# EAGLE design old_kick_line (EAGLE 7.7.0)
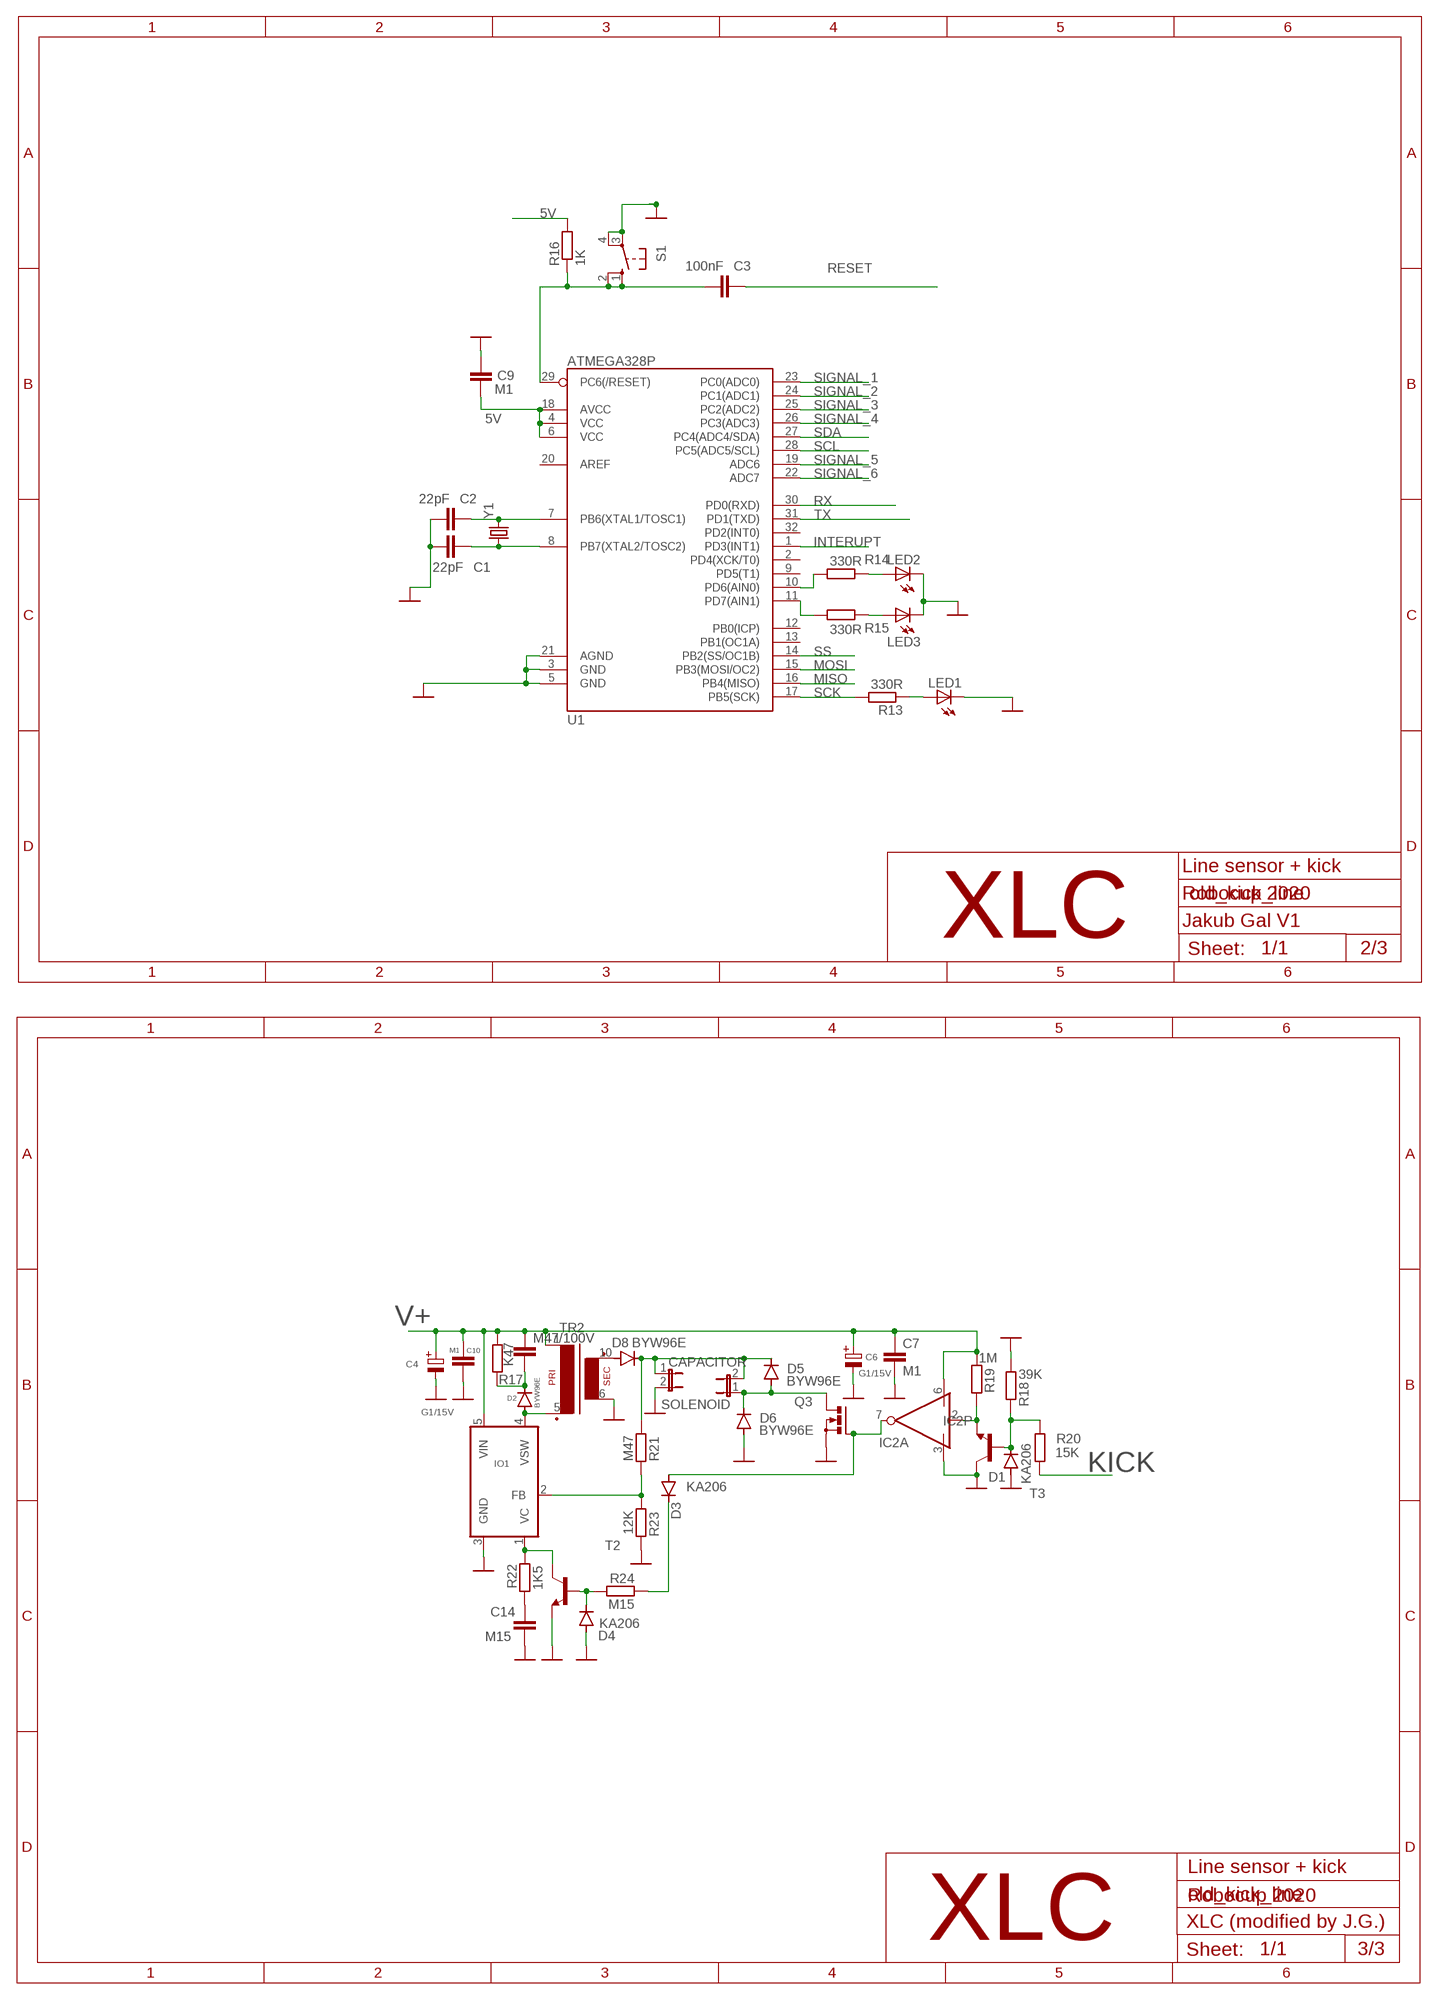
[diagram p0: schematic, sheet 1, part 1 of 2]
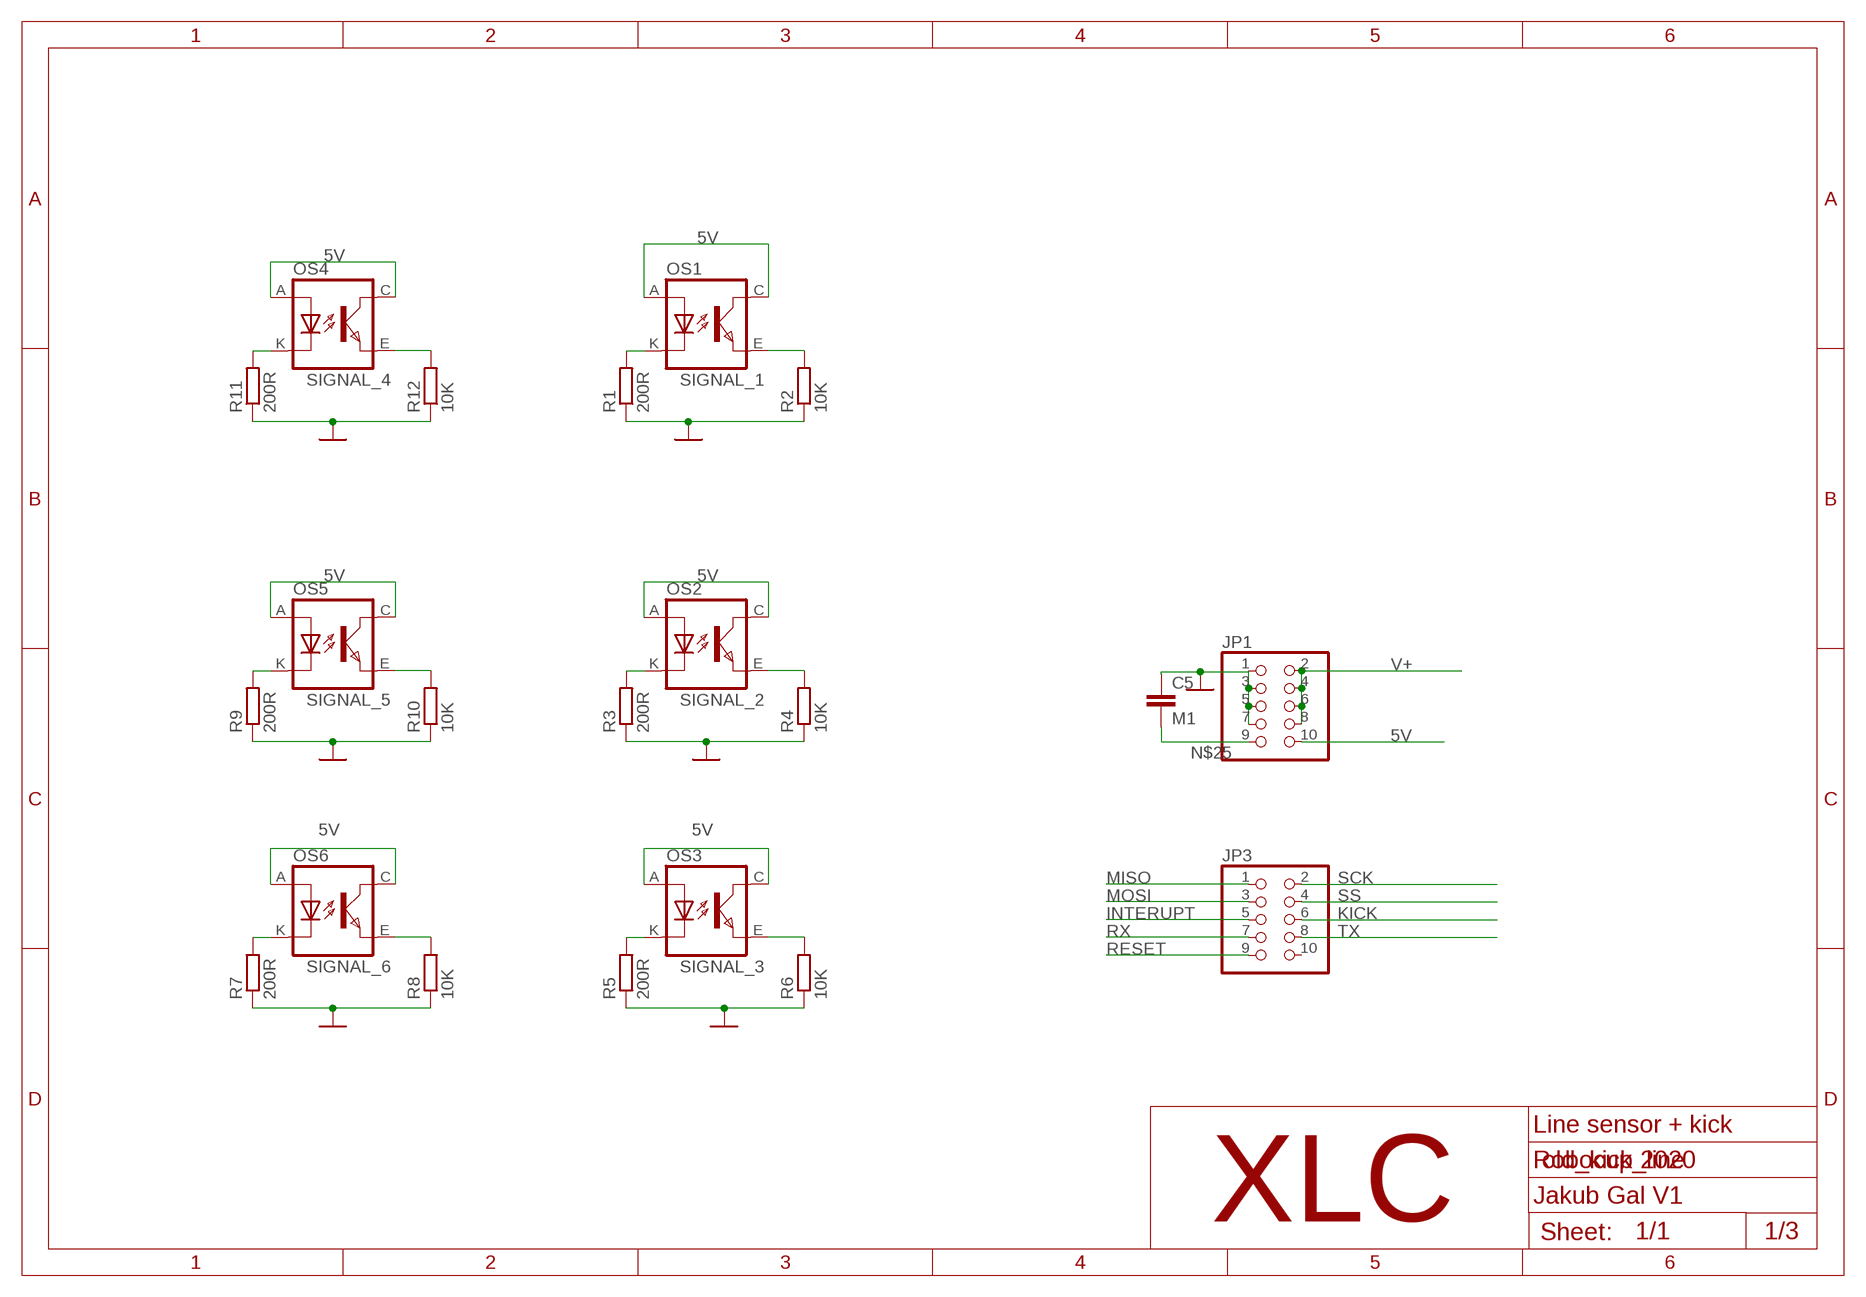
[diagram p1: schematic, sheet 1, part 2 of 2]

## Parts
C1  22pF  C-EUC0603  [C0603]
C2  22pF  C-EUC0603  [C0603]
C3  100nF  C-EUC0603  [C0603]
C4  G1/15V  KOND-ELEKT-2,5/7  [E-2,5/7-RAD]
C5  M1  C-EUC0603  [C0603]
C6  G1/15V  KOND-ELEKT-2,5/7  [E-2,5/7-RAD]
C7  M1  C-EUC0805K  [C0805K]
C9  M1  C-EUC0603  [C0603]
C10  M1  C-EUC0805K  [C0805K]
C14  M15  C-EUC0805K  [C0805K]
CAPACITOR  JP1E  [JP1]
D1  KA206  DIODE-D-7.5  [D-7.5]
D2  BYW96E  BYW96  [SOD64-10]
D3  KA206  DIODE-D-7.5  [D-7.5]
D4  KA206  DIODE-D-7.5  [D-7.5]
D5  BYW96E  BYW96  [SOD64-10]
D6  BYW96E  BYW96  [SOD64-10]
D8  BYW96E  BYW96  [SOD64-10]
IC2  MIC4423BM  [SO08]
IO1  LT1071V  [TO220-5P]
JP1  PINHD-2X5IDC  [2X05_IDC]
JP3  PINHD-2X5IDC  [2X05_IDC]
LED1  LEDCHIPLED_0603  [CHIPLED_0603]
LED2  LEDCHIPLED_0603  [CHIPLED_0603]
LED3  LEDCHIPLED_0603  [CHIPLED_0603]
M47/100V  C-EUC0805K  [C0805K]
OS1  TCRT5000  [TCRT5000]
OS2  TCRT5000  [TCRT5000]
OS3  TCRT5000  [TCRT5000]
OS4  TCRT5000  [TCRT5000]
OS5  TCRT5000  [TCRT5000]
OS6  TCRT5000  [TCRT5000]
Q3  PMOSFET_NTO220BV  [TO220BV]
R1  200R  R-EU_R0603  [R0603]
R2  10K  R-EU_R0603  [R0603]
R3  200R  R-EU_R0603  [R0603]
R4  10K  R-EU_R0603  [R0603]
R5  200R  R-EU_R0603  [R0603]
R6  10K  R-EU_R0603  [R0603]
R7  200R  R-EU_R0603  [R0603]
R8  10K  R-EU_R0603  [R0603]
R9  200R  R-EU_R0603  [R0603]
R10  10K  R-EU_R0603  [R0603]
R11  200R  R-EU_R0603  [R0603]
R12  10K  R-EU_R0603  [R0603]
R13  330R  R-EU_R0603  [R0603]
R14  330R  R-EU_R0603  [R0603]
R15  330R  R-EU_R0603  [R0603]
R16  1K  R-EU_R0603  [R0603]
R17  K47  R-EU_R0603  [R0603]
R18  39K  R-EU_R0603  [R0603]
R19  1M  R-EU_R0603  [R0603]
R20  15K  R-EU_R0603  [R0603]
R21  M47  R-EU_R0603  [R0603]
R22  1K5  R-EU_R0603  [R0603]
R23  12K  R-EU_R0603  [R0603]
R24  M15  R-EU_R0603  [R0603]
S1  10-XX  [B3F-10XX]
SOLENOID  JP1E  [JP1]
T2  -NPN-SC59-BEC  [SC59-BEC]
T3  -NPN-SC59-BEC  [SC59-BEC]
TR2  TRAFO-E10-R""  [TRAFO-EE17X20]
U1  ATMEGA328P  ATMEGA328_SMT  [TQFP32-08]
Y1  CRYSTALHC49US  [HC49US]

## Nets
5V: C9.1 JP1.10 OS1.A(ANODE) OS1.C(COLLECTOR) OS2.A(ANODE) OS2.C(COLLECTOR) OS3.A(ANODE) OS3.C(COLLECTOR) OS4.A(ANODE) OS4.C(COLLECTOR) OS5.A(ANODE) OS5.C(COLLECTOR) OS6.A(ANODE) OS6.C(COLLECTOR) R16.2 U1.4(VCC) U1.6(VCC) U1.18(AVCC)
GND: C1.1 C2.1 C4.- C5.1 C6.- C7.2 C9.2 C10.2 C14.2 CAPACITOR.2 D1.A D4.A D6.A IC2.3(P:GND) IO1.3(GND) JP1.1 JP1.3 JP1.5 JP1.7 LED1.C LED2.C LED3.C Q3.S R1.1 R2.1 R3.1 R4.1 R5.1 R6.1 R7.1 R8.1 R9.1 R10.1 R11.1 R12.1 R18.2 R23.1 S1.3(P) S1.4(P1) T2.E T3.C TR2.6 U1.3(GND) U1.5(GND) U1.21(AGND)
INTERUPT: JP3.5 U1.1(PD3(INT1))
KICK: JP3.6 R20.1
MISO: JP3.1 U1.16(PB4(MISO))
MOSI: JP3.3 U1.15(PB3(MOSI/OC2))
N$1: OS1.K(CATHODE) R1.2
N$2: OS2.K(CATHODE) R3.2
N$3: OS3.K(CATHODE) R5.2
N$4: OS6.K(CATHODE) R7.2
N$5: OS5.K(CATHODE) R9.2
N$6: OS4.K(CATHODE) R11.2
N$7: C2.2 U1.7(PB6(XTAL1/TOSC1)) Y1.2
N$8: C1.2 U1.8(PB7(XTAL2/TOSC2)) Y1.1
N$9: IO1.1(VC) R22.1 T2.C
N$10: C14.1 R22.2
N$11: D8.A TR2.10
N$12: D3.A IC2.7(A:OUT) Q3.G
N$13: CAPACITOR.1 D5.C D8.C R21.2 SOLENOID.2
N$14: IO1.2(FB) R21.1 R23.2
N$15: D4.C R24.2 T2.B
N$16: C3.1 R16.1 S1.1(S) S1.2(S1) U1.29(PC6(/RESET))
N$17: LED1.A R13.1
N$18: IC2.2(A:IN) R19.1 T3.E
N$19: LED2.A R14.1
N$20: R15.2 U1.11(PD7(AIN1))
N$21: LED3.A R15.1
N$22: R14.2 U1.10(PD6(AIN0))
N$23: D2.A IO1.4(VSW) TR2.5
N$24: D2.C M47/100V.2 R17.2
N$25: C5.2 JP1.9
N$26: D5.A D6.C Q3.D SOLENOID.1
N$29: D3.C R24.1
N$31: D1.C R18.1 R20.2 T3.B
RESET: C3.2 JP3.9
RX: JP3.7 U1.30(PD0(RXD))
SCK: JP3.2 R13.2 U1.17(PB5(SCK))
SCL: U1.28(PC5(ADC5/SCL))
SDA: U1.27(PC4(ADC4/SDA))
SIGNAL_1: OS1.E(EMITTER) R2.2 U1.23(PC0(ADC0))
SIGNAL_2: OS2.E(EMITTER) R4.2 U1.24(PC1(ADC1))
SIGNAL_3: OS3.E(EMITTER) R6.2 U1.25(PC2(ADC2))
SIGNAL_4: OS4.E(EMITTER) R12.2 U1.26(PC3(ADC3))
SIGNAL_5: OS5.E(EMITTER) R10.2 U1.19(ADC6)
SIGNAL_6: OS6.E(EMITTER) R8.2 U1.22(ADC7)
SS: JP3.4 U1.14(PB2(SS/OC1B))
TX: JP3.8 U1.31(PD1(TXD))
V+: C4.+ C6.+ C7.1 C10.1 IC2.6(P:V+) IO1.5(VIN) JP1.2 JP1.4 JP1.6 JP1.8 M47/100V.1 R17.1 R19.2 TR2.1
Unconnected: IC2.4(B:IN) IC2.5(B:OUT) JP3.10 U1.2(PD4(XCK/T0)) U1.9(PD5(T1)) U1.12(PB0(ICP)) U1.13(PB1(OC1A)) U1.20(AREF) U1.32(PD2(INT0))

## Notes on the sheet
- Line sensor + kick
- Robocup 2020
- Jakub Gal V1
- XLC
- 2/3
- Line sensor + kick
- Robocup 2020
- XLC (modified by J.G.)
- XLC
- 3/3
- Line sensor + kick
- Robocup 2020
- Jakub Gal V1
- XLC
- 1/3

## Library data of the parts
C1-C3 C9 = rcl@1:C-EU: CAPACITOR, European symbol
C4 C6 = TABOR K1:KOND-ELEKT: Kondenzátor elektrolyticky
C5 = rcl:C-EU: CAPACITOR, European symbol; SPICEPREFIX: C
C7 C10 C14 M47/100V = resistor:C-EU: CAPACITOR, European symbol
CAPACITOR SOLENOID = jumper:JP1E: JUMPER
D1 D3 D4 = diode:DIODE-: DIODE
D2 D5 D6 D8 = diode:BYW96: DIODE fast soft-recovery rectifier
IC2 = TABOR K1:MIC4423B: 2x Invertor driver MOSFET
IO1 = TABOR K1:LT1071: DC/DC pulzny IO
JP1 JP3 = pinhead-1:PINHD-2X5: PIN HEADER
LED1-LED3 = audio amplifier example:LED
OS1-OS3 OS5 = tcrt5000:TCRT5000
OS4 OS6 = tcrt5000:TCRT5000; SPICEPREFIX: O
Q3 = transistor-power:PMOSFET_N: Power MOSFET N-Channel
R1-R16 = rcl:R-EU_: RESISTOR, European symbol; SPICEPREFIX: R
R17-R24 = resistor:R-EU_: RESISTOR, European symbol
S1 = switch-omron:10-XX: OMRON SWITCH; MPN: B3F-1000; OC_FARNELL: 176432; OC_NEWARK: 36M3542
T2 T3 = DC_LOAD_AU:*-NPN-: NPN Transistror BF959 corrected 2008.03.06
TR2 = TABOR K1:TRAFO-E10-R: Transformátor s feritovym jadrom EE17x20: 1x primár, 1x sekundár
U1 = SparkFun-DigitalIC:ATMEGA328_SMT: 32-Pin Atmega328 part Commonly used on Arduino compatible boards Available in QFP and QFN packages TQFP is IC-09069 QFN is non-stock; PROD_ID: IC-09069
Y1 = SparkFun-FreqCtrl:CRYSTAL: Various standard crystals. Proven footprints. Spark Fun Electronics SKU : COM-00534

## Board
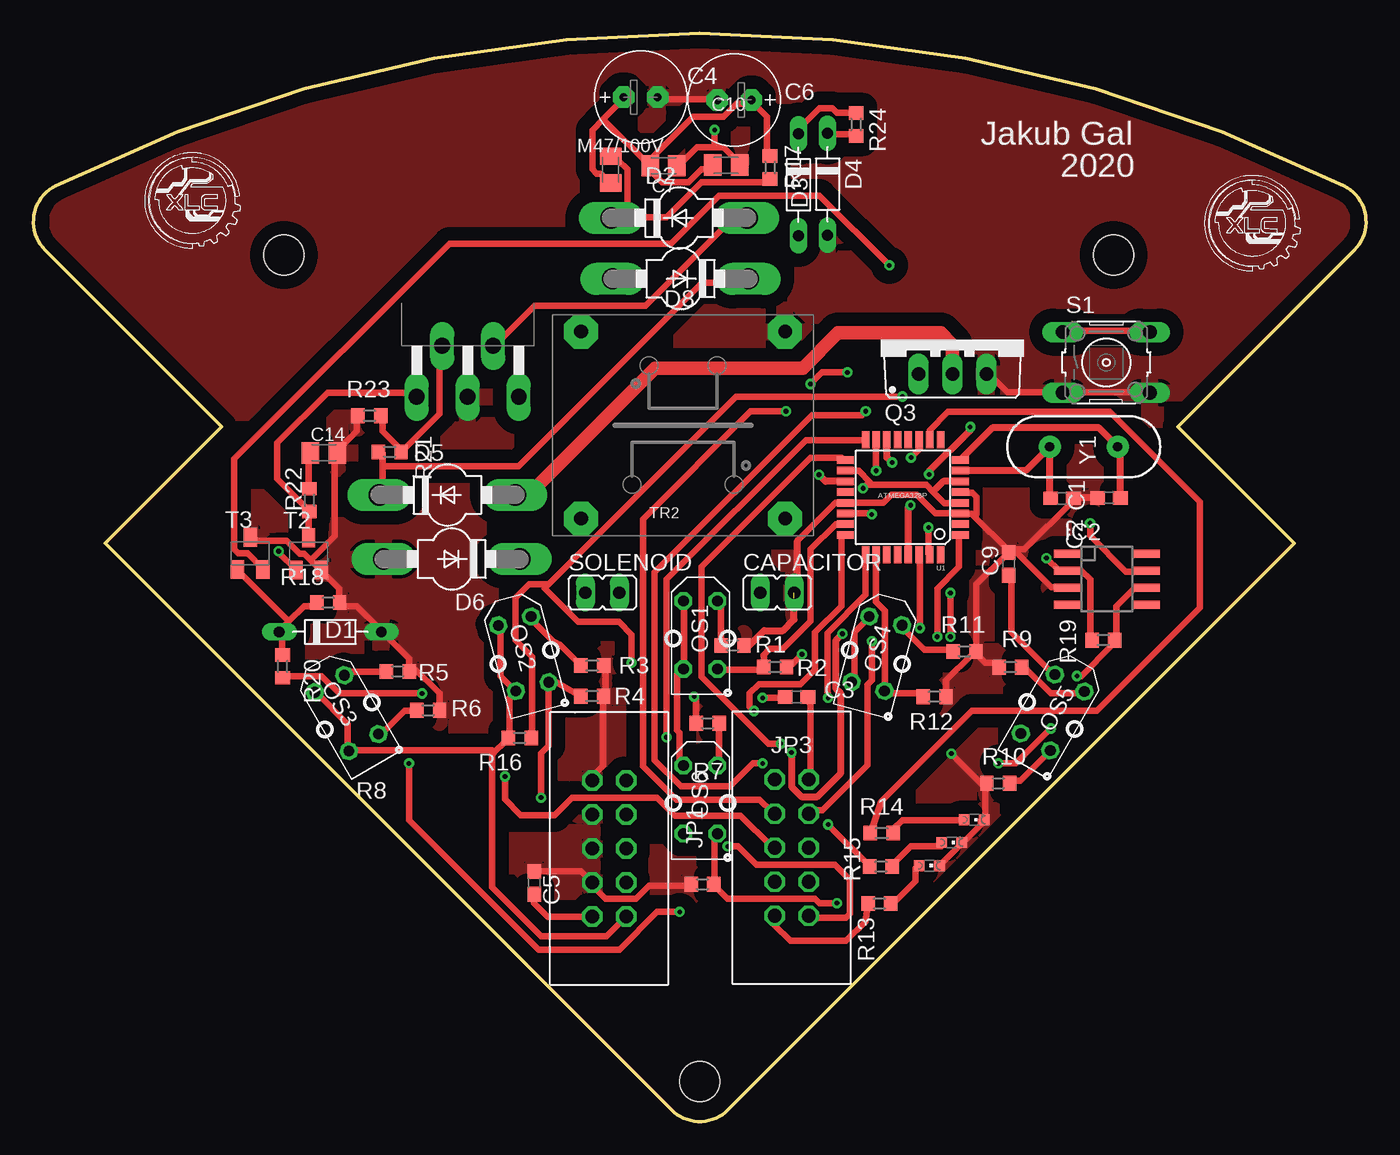
[diagram p2: board, top side]
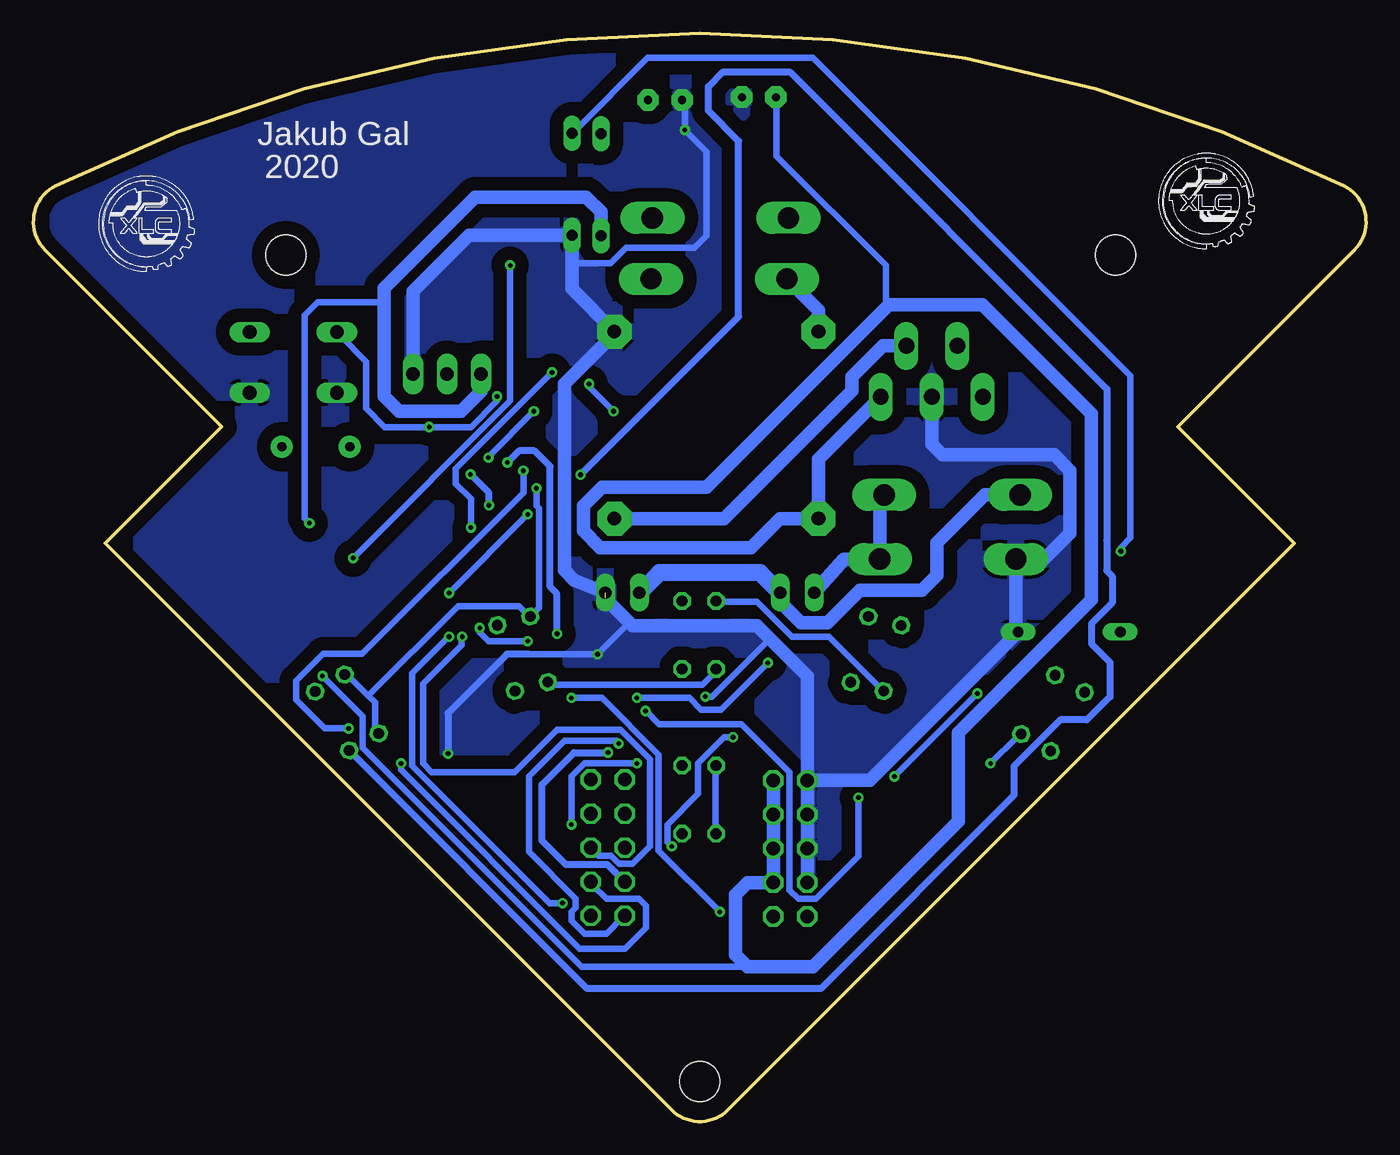
[diagram p3: board, bottom side, seen from below]

Size 99.55 x 81.25 mm. Coordinates in mm from the lower left corner, seen from the top.
Outline: 85.49,51.89 98.67,65.08 arc108 97.9,69.88 arc53 1.66,69.88 arc108 0.88,65.08 14.07,51.89 5.35,43.18 47.66,0.87 arc90 51.9,0.87 94.2,43.18 85.49,51.89
Copper layers (1*16): Top 0.035mm / dielectric 1.5mm / Bottom 0.035mm
Design rules "default *": minimum track width 0.5mm, minimum drill 0.35mm, track to track 6mil, track to pad 6mil, pad to pad 6mil, via to via 6mil, smd to smd 6mil, copper to edge 40mil, drill to drill 6mil, minimum pad ring 10mil, minimum via ring 8mil, stop-mask expansion 4mil, vias tented up to drill 0mil, thermal gap 10mil
Holes 3 mm at 49.78,3 18.71,64.71 80.71,64.71

### Footprints (pad centres in the part's own frame; a part is rotated, then mirrored left to right if it is on the bottom)
C0603 = smd 1.1 x 1: 1 -0.85,0; 2 0.85,0
E-2,5/7-RAD = drill 0.61 pad 1.6 octagon: + -1.27,0; - 1.27,0
C0805K = smd 1.3 x 1.6: 1 -1,0; 2 1,0
JP1 = drill 0.914 long: 1 0,-1.27; 2 0,1.27
D-7.5 = drill 0.813 long: A 3.81,0; C -3.81,0
SOD64-10 = drill 1.6 long: A 5.08,0; C -5.08,0
SO08 = smd 0.61 x 1.981: 1 -1.905,-2.972; 2 -0.635,-2.972; 3 0.635,-2.972; 4 1.905,-2.972; 5 1.905,2.972; 6 0.635,2.972; 7 -0.635,2.972; 8 -1.905,2.972
TO220-5P = drill 1.194 pad 1.676 long: 1 -3.81,0; 2 -1.905,3.81; 3 0,0; 4 1.905,3.81; 5 3.81,0
2X05_IDC = drill 1.016 octagon: 1 -5.08,-1.27; 2 -5.08,1.27; 3 -2.54,-1.27; 4 -2.54,1.27; 5 0,-1.27; 6 0,1.27; 7 2.54,-1.27; 8 2.54,1.27; 9 5.08,-1.27; 10 5.08,1.27
CHIPLED_0603 = smd 0.8 x 0.8: A 0,-0.75; C 0,0.75
TCRT5000 = drill 0.8 octagon: A -2.54,-1.27; C 2.54,-1.27; E 2.54,1.27; K -2.54,1.27
TO220BV = drill 1.016 long: D 0,-2.54; G -2.54,-2.54; S 2.54,-2.54
R0603 = smd 1 x 1.1: 1 -0.85,0; 2 0.85,0
B3F-10XX = drill 1.016 long: 1 -3.251,2.261; 2 3.251,2.261; 3 -3.251,-2.261; 4 3.251,-2.261
SC59-BEC = smd 1 x 1.4: B -0.95,-1.2; C 0,1.2; E 0.95,-1.2
TRAFO-EE17X20 = drill 1.016 pad 2.54 octagon: 1 -7.62,-7.62; 5 7.62,-7.62; 6 7.62,6.35; 10 -7.62,6.35
TQFP32-08 = smd 1.27 x 0.559: 1 -4.293,2.8; 2 -4.293,2; 3 -4.293,1.2; 4 -4.293,0.4; 5 -4.293,-0.4; 6 -4.293,-1.2; 7 -4.293,-2; 8 -4.293,-2.8; 17 4.293,-2.8; 18 4.293,-2; 19 4.293,-1.2; 20 4.293,-0.4; 21 4.293,0.4; 22 4.293,1.2; 23 4.293,2; 24 4.293,2.8 | smd 0.559 x 1.27: 9 -2.8,-4.293; 10 -2,-4.293; 11 -1.2,-4.293; 12 -0.4,-4.293; 13 0.4,-4.293; 14 1.2,-4.293; 15 2,-4.293; 16 2.8,-4.293; 25 2.8,4.293; 26 2,4.293; 27 1.2,4.293; 28 0.4,4.293; 29 -0.4,4.293; 30 -1.2,4.293; 31 -2,4.293; 32 -2.8,4.293
HC49US = drill 0.7 pad 1.651: 1 -2.54,0; 2 2.54,0

### Placement (x,y rotation side)
C1  80.35,46.58 0 top
C2  76.84,46.55 180 top
C3  57.01,31.7 0 top
C4  45.36,76.5 0 top
C5  37.41,17.83 270 top
C6  52.37,76.29 180 top
C7  47.07,71.38 0 top
C9  72.86,41.65 90 top
C10  51.76,71.42 0 top
C14  21.7,49.94 0 top
CAPACITOR  55.56,39.5 270 top
D1  22.18,36.56 0 top
D2  48.23,67.49 0 top
D3  57.15,69.96 270 top
D4  59.33,70 270 top
D5  30.93,46.8 0 top
D6  31.24,42 180 top
D8  48.34,62.94 180 top
IC2  80.2,40.51 270 top
IO1  32.45,54.12 0 top
JP1  43.01,20.39 270 top
JP3  56.64,20.45 90 top
LED1  66.93,19.11 270 top
LED2  70.28,22.54 270 top
LED3  68.6,20.84 270 top
M47/100V  43.12,71.09 90 top
OS1  49.83,36.34 270 top
OS2  36.61,34.93 285 top
OS3  23.4,30.5 300 top
OS4  63.01,34.94 255 top
OS5  76.13,30.54 240 top
OS6  49.83,24.04 270 top
Q3  68.66,58.37 0 top
R1  52.23,35.56 180 top
R2  55.41,33.94 180 top
R3  41.75,34.05 180 top
R4  41.74,31.77 180 top
R5  27.22,33.62 180 top
R6  29.49,30.71 180 top
R7  50.37,29.74 0 top
R8  49.98,17.72 0 top
R9  72.98,33.93 0 top
R10  72.08,25.26 0 top
R11  69.56,35.11 180 top
R12  67.32,31.73 180 top
R13  63.2,16.28 180 top
R14  63.37,21.54 180 top
R15  63.31,19.04 180 top
R16  36.33,28.65 180 top
R17  55.03,71.25 270 top
R18  22.02,38.76 0 top
R19  79.93,35.95 0 top
R20  18.61,33.99 90 top
R21  26.62,50.01 180 top
R22  20.62,46.41 90 top
R23  25.1,52.71 0 top
R24  61.46,74.46 270 top
S1  80.15,56.69 0 top
SOLENOID  42.5,39.5 270 top
T2  20.56,42.39 0 top
T3  16.2,42.43 0 top
TR2  48.53,52.65 0 top
U1  64.96,46.61 180 top
Y1  78.46,50.39 180 top

### Tracks (layer width: path | path; a pad name or v marks a point on that pad's centre or on a via)
5V  (via drill 0.35)
  Top 0.5: OS3.A 21.2,31.96 23.48,29.68 23.48,27.72 OS3.C 23.81,27.72 34.25,27.72 34.41,27.56 | OS2.A 34.9,36.86 34.9,33.27 35.88,32.29 OS2.C 35.88,31.96 35.55,31.64 35.55,28.7 R16.2 35.23,28.38 34.41,27.56 | 34.41,27.56 34.25,27.4 34.25,17.5 37.92,13.82 42.8,13.82 44.26,15.28 JP1.10 | C9.1 73.07,40.77 73.07,36.53 76,33.6 OS5.A | 62.15,47.47 62.18,47.44 62.29,47.55 66.69,47.55 67.2,47.04 68.06,46.18 69.22,46.18 U1.4 | U1.18 61.65,48.6 62.47,47.78 62.15,47.47 | OS4.C 61.32,32.94 61.32,36.53 62.3,37.51 OS4.A | OS1.A 48.6,38.81 48.6,33.92 OS1.C 48.28,33.6 48.07,33.39 48.07,29.23 48.28,29.03 48.28,26.74 OS6.A | v61.98,47.3 62.15,47.47
  Top 0.508: U1.6 67.97,47.81 67.2,47.04
  Bottom 0.5: 74.54,31.8 76,33.27 OS5.A | 74.54,31.8 74.05,31.31 74.05,29.03 OS5.C | OS6.C 48.6,21.53 48.6,26.42 OS6.A | OS4.C 61,32.62 49.58,32.62 48.6,33.6 OS1.C | v61.98,47.3 61.98,45.99 61.77,45.79 61.77,38.36 62.3,37.84 OS4.A 62.63,37.84 63.28,38.49 67.85,38.49 74.54,31.8 | OS2.C 36.21,32.29 40.12,36.21 42.89,36.21 45.49,38.81 48.28,38.81 OS1.A
GND  (via drill 0.35)  (1 unrouted)
  Top 0.5: R12.1 68.17,31.96 68.17,32.94 70.13,34.9 R11.1 | R9.1 72.09,34.25 71.11,34.25 70.46,34.9 R11.1 | 70.29,45.18 70.07,45.4 69.28,45.4 U1.3 69.24,45.42 67.37,45.42 65.98,46.81 64.11,46.81 63.51,46.21 U1.21 60.64,46.22 59.92,46.22 57.08,43.38 | 70.29,45.18 72.74,42.73 C9.2 | U1.5 69.48,46.97 70.13,46.97 70.46,46.64 70.46,45.34 70.29,45.18 | 73.21,42.73 73.07,42.73 C9.2 | 73.21,42.73 74.05,42.73 77.63,46.32 C2.1 | 73.21,42.73 76.04,39.9 77.2,39.9 IC2.3 | R11.1 70.46,35.23 70.46,40.12 72.74,42.4 C9.2 | R23.1 24.14,52.51 24.14,51.54 22.83,50.23 C14.2 22.51,49.91 22.51,43.71 20.71,41.91 | 20.71,41.91 21.2,41.42 T2.E 21.53,41.1 22.83,39.79 22.83,38.81 R18.2 23.16,38.49 24.14,38.49 25.77,36.86 D1.A 26.09,36.53 28.05,34.57 28.05,33.92 R5.1 28.38,33.92 30.34,31.96 30.34,30.99 R6.1 | 20.71,41.91 20.22,42.4 19.9,42.4 18.92,43.38 16.31,43.38 T3.C | 50.89,72.74 51.54,72.74 52.84,71.43 C10.2 | 50.89,72.74 49.58,72.74 48.28,71.43 C7.2 | C6.- 50.89,76.33 46.65,76.33 C4.- | v50.89,74.04 50.89,72.74 | LED1.C 67.85,19.24 69.15,20.55 LED3.C 69.48,20.87 70.78,22.18 70.78,22.5 LED2.C 71.11,22.83 71.11,25.11 R10.1 70.79,25.26 v68.58,27.47 | R3.1 42.75,33.57 42.75,31.93 R4.1 42.56,31.75 42.56,26.57 41.75,25.77 JP1.1 | C5.1 40.91,18.68 JP1.7 41.75,17.61 42.73,16.63 45.01,16.63 45.99,17.61 48.93,17.61 R8.1 | v49.36,31.73 49.51,31.58 R7.1 | v57.41,34.9 56.51,34 R2.1 | Q3.S 71.44,55.78 72.74,54.47 76.66,54.47 S1.3 76.98,54.47 83.18,54.47 S1.4
  Top 0.508: C1.1 77.72,46.58 C2.1 | R1.1 53.48,35.56 54.59,36.67 55.99,36.67 56.83,37.51 CAPACITOR.2 57.08,39.75 57.08,43.38
  Bottom 0.5: C6.- 50.89,76 v50.89,74.04 49.27,72.43 49.27,66.15 50.18,65.24 55.29,65.24 56.45,64.09 59.33,64.09 | 44.53,36.05 48.85,31.73 v49.36,31.73 | 54.8,37.04 55.13,37.18 v57.41,34.9 62.55,34.9
  Bottom 0.508: 62.55,34.9 64.19,34.9 68.58,30.51 v68.58,27.47
  Bottom 1.016: JP1.7 JP1.5 JP1.3 JP1.1 | JP1.1 37.08,25.47 D1.A 26.16,36.73 D6.A 24.06,42 22.11,43.95 22.11,48.61 23.28,49.78 31.64,49.78 32.45,50.59 IO1.3 | 56.83,39.09 56.84,39.08 54.8,37.04 45.51,37.04 44.53,36.05 41.74,33.27 JP1.1 | CAPACITOR.2 59.18,40.44 59.89,41.15 59.89,55.08 56.15,58.83 TR2.6 59.33,62.18 59.33,64.09 D4.A 67.01,66.19 71.2,62 Q3.S
  pour Bottom (isolate 1): -9,-8.79 108,-8.79 108,83.3 -9,83.3
  pour Top (isolate 1): -7,82 106.43,82 106.43,-7 -7,-7
INTERUPT  (via drill 0.35)
  Top 0.5: v67.52,36.2 67.52,39.79 69.15,41.42 69.15,43.71 U1.1
  Bottom 0.5: v67.52,36.2 67.57,36.15 67.57,35.57 70.46,32.68 70.46,26.74 69.81,26.09 63.59,26.09 60.43,29.26 55.68,29.26 53.5,27.07 53.5,20.55 54.8,19.24 55.78,19.24 55.82,19.28 55.85,19.28 56.4,19.83 57.35,19.83 57.74,20.22 JP3.5
KICK  (via drill 0.35)
  Top 0.5: v29.03,31.96 22.83,31.96 21.53,33.27 18.92,33.27 R20.1 | v35.23,25.77 35.23,24.05 36.4,22.88 38.91,22.88 40.23,24.2 46.58,24.2 47.93,22.84 52.83,22.84 55.13,20.55 JP3.6
  Bottom 0.5: v35.23,25.77 v29.03,31.96
MISO  (via drill 0.35)
  Top 0.5: v47.3,28.7 47.3,40.48 57.7,50.88 61.98,50.88 U1.16 | v51.86,20.55 52.63,20.55 54,19.17 59.87,19.17 61,18.04 61,15.51 60.7,15.21 58.54,15.21 JP3.1
  Bottom 0.5: v47.3,28.7 47.95,28.7 49.91,26.74 49.91,24.46 52.19,22.18 52.19,20.87 v51.86,20.55
MOSI  (via drill 0.35)
  Top 0.5: v62.96,48.6 62.96,50.88 U1.15 | v76,29.35 73.39,26.74 v72.09,26.74
  Bottom 0.5: v62.96,48.6 62.96,46.97 74.99,34.93 77.9,34.93 79.92,32.92 79.92,31.49 77.78,29.35 v76,29.35 | v72.09,26.74 72.09,26.26 58.74,12.91 55.34,12.91 53.79,14.47 53.79,16.1 54.32,16.63 56.76,16.63 57.74,17.61 JP3.3
N$1
  Top 0.5: OS1.K 51.38,38.6 R1.2
N$2
  Top 0.5: R3.2 39.32,35.62 38.82,35.88 37.19,37.51 OS2.K
N$3
  Top 0.5: R5.2 26.09,33.6 23.48,33.6 OS3.K
N$4
  Top 0.5: OS6.K 51.22,26.69 R7.2
N$5
  Top 0.5: R9.2 74.05,33.92 76,31.96 78.29,31.96 OS5.K
N$6
  Top 0.5: R11.2 68.5,35.23 66.54,35.23 64.91,36.86 OS4.K
N$7
  Top 0.508: C2.2 75.92,46.62 Y1.2 74.14,48.61 U1.7
N$8
  Top 0.508: C1.2 81.2,50.19 Y1.1 79.55,51.84 71.68,51.84 U1.8
N$9
  Top 0.5: T2.C 20.55,43.71 20.55,45.34 R22.1 20.55,45.66 18.21,48 18.21,50.67 21.97,54.43 28.33,54.43 IO1.1
N$10
  Top 0.5: R22.2 20.55,47.3 20.55,49.91 C14.1
N$11
  Bottom 1.016: D8.A 40.91,60.59 TR2.10
N$12  (via drill 0.35)
  Top 0.5: IC2.7 83.1,41.07 81.6,41.07 78.94,43.74 v78.94,44.69
  Bottom 0.5: v78.94,44.69 79.29,45.04 79.29,60.21 78.32,61.18 73.36,61.18
  Bottom 1.016: Q3.G 66.12,54.53 67.6,53.05 72.25,53.05 73.36,54.16 73.36,61.18 73.36,62.23 66.55,69.04 58.26,69.04 57.15,67.93 D3.A
N$13
  Top 0.5: 26.09,48.93 26.09,46.98 D5.C | 26.09,48.93 26.09,49.91 R21.2 | 26.09,48.93 36.23,48.93 49.93,62.63 53.17,62.63 D8.C
  Bottom 1.016: SOLENOID.2 43.72,39.7 43.72,38.74 42.22,37.24 40.22,37.24 37.8,39.66 33.19,39.66 32.05,40.8 32.05,43.22 28.47,46.8 D5.C
  Bottom 1.27: SOLENOID.2 45.26,40.99 52.8,40.99 CAPACITOR.1
N$14
  Top 0.5: R23.2 26.09,52.51 26.09,51.54 27.4,50.23 R21.1 27.73,50.23 30.34,52.84 30.34,57.73 IO1.2
N$15  (via drill 0.35)
  Top 0.5: R24.2 61.32,73.72 59.37,73.72 D4.C | v18.32,42.58 18.32,42.48 19.61,41.2 T2.B
  Bottom 0.5: D4.C 59.04,74.04 53.66,79.42 41.32,79.42 17.59,55.7 17.59,43.58 18.32,42.85 v18.32,42.58
N$16  (via drill 0.35)
  Top 0.5: 38.49,40.12 37.02,40.12 36.01,39.11 36.01,35.95 37.27,34.7 37.27,29.36 R16.1 | 38.49,40.12 52.48,54.11 64.88,54.11 v64.91,54.15 | 38.49,40.12 38.18,39.81 40.67,37.32 43.74,37.32 44.69,36.37 v44.69,34.25 | v54.47,31.64 56.11,31.64 C3.1 | S1.2 83.18,59.04 76.98,59.04 S1.1
  Top 0.508: U1.29 65.36,45.86 v65.53,46.03 | v66.91,48.33 66.91,48.55 69.99,51.63 v69.99,51.86
  Bottom 0.5: v64.91,54.15 64.91,53.82 66.87,51.86 v69.99,51.86 73.3,51.86 74.7,53.26 74.7,56.76 76.66,58.71 S1.1 | v54.47,31.64 50.56,31.64 49.66,30.74 48.19,30.74 v44.69,34.25
  Bottom 0.508: v65.53,46.03 65.53,46.95 v66.91,48.33
N$17
  Top 0.5: LED1.A 65.89,18.92 65.89,17.94 64.26,16.31 R13.1
N$18  (via drill 0.35)
  Top 0.5: R19.1 78.94,36.2 78.94,40.5 78.34,41.1 77.31,41.1 IC2.2 77.2,41.11 76.64,41.11 v75.68,42.08 | v63.93,63.93 58.71,69.15 51.21,69.15 47.62,65.56 31.08,65.56 15,49.49 15,42.73 15.29,42.44 15.99,42.44 T3.E
  Bottom 0.5: v63.93,63.93 63.93,53.82 v75.68,42.08
N$19
  Top 0.5: LED2.A 69.48,22.5 64.91,22.5 64.26,21.85 R14.1
N$20  (via drill 0.35)
  Top 0.5: v59.37,22.18 62.3,19.24 R15.2 | v54.47,26.74 53.75,26.74 52.03,25.02 48.37,25.02 46.41,26.98 46.41,41.01 58.15,52.76 61.9,52.76 v62.18,53.04 | v65.56,49.58 66.22,50.23 66.22,50.88 U1.11
  Bottom 0.5: v59.37,22.18 59.37,25.77 58.39,26.74 v54.47,26.74 | v65.56,49.58 65.56,49.65 v62.18,53.04
N$21
  Top 0.5: LED3.A 67.85,20.55 65.56,20.55 64.26,19.24 R15.1
N$22
  Top 0.5: U1.10 66.97,50.91 66.97,51.64 68.32,52.99 80.42,52.99 87.13,46.28 87.13,38.36 79.43,30.66 70.1,30.66 63.35,23.91 R14.2
N$23
  Top 0.5: D2.A 53.17,67.19 52.01,67.19 45.73,60.91 37.43,60.91 34.58,58.06 IO1.4
  Bottom 1.016: TR2.5 47.97,45.03 38.42,54.58 38.42,55.61 36.1,57.93 IO1.4
N$24
  Top 0.5: 44.36,67.52 43.38,67.52 D2.C 44.36,67.52 | 44.36,67.52 47.3,67.52 49.91,70.13 54.8,70.13 R17.2 | 44.36,67.52 44.36,71.11 43.71,71.76 43.38,71.76 M47/100V.2
N$25
  Top 0.5: JP1.9 38.41,15.3 37.41,16.3 C5.2
N$26
  Top 1.016: Q3.D 68.66,58.03 67.8,58.89 60.11,58.89 57.47,56.25 46.43,56.25 36.98,46.8 D5.A
  Bottom 1.016: D5.A 36.32,46.49 D6.C 39.02,42 SOLENOID.1
N$29
  Top 0.5: R24.1 61.32,75.35 60.02,75.35 59.69,75.67 58.71,75.67 57.08,74.04 D3.C
N$31
  Top 0.5: R20.2 18.59,34.9 18.59,36.53 D1.C 18.59,36.86 19.08,37.35 | 19.08,37.35 20.22,38.49 20.88,38.49 R18.1 | 19.08,37.35 15.33,41.1 T3.B
RESET
  Top 0.5: C3.2 58.06,31.14 58.06,25.77 JP3.9
RX  (via drill 0.35)
  Top 0.5: v66.22,36.86 66.22,42.08 U1.30 | v62.63,35.88 62.63,32.94 62.3,32.62 62.3,26.61 58.95,23.26 58.17,23.26 58.06,23.16 JP3.7
  Bottom 0.5: v66.22,36.86 66.22,36.53 65.56,35.88 v62.63,35.88
SCK  (via drill 0.35)
  Top 0.5: JP3.2 55.37,14.67 56.54,13.5 60.72,13.5 62.14,14.93 R13.2 | v55.83,28.22 54.9,28.22 49.91,33.22 49.91,41.42 58.06,49.58 60.35,49.58 U1.17
  Bottom 0.5: JP3.2 55.45,15.33 56.76,14.02 58.39,14.02 59.37,15 59.37,15.65 59.04,15.98 59.04,16.63 62.53,20.13 62.53,25.78 59.86,28.45 55.98,28.45 55.83,28.31 v55.83,28.22
SIGNAL_1
  Top 0.5: OS1.E 51.15,33.74 54.37,33.74 R2.2 54.56,34.63 54.52,34.81 55,35.29 56,35.29 58.06,37.35 58.06,42.73 59.95,44.62 60.63,44.62 U1.23
SIGNAL_2  (via drill 0.35)
  Top 0.5: R4.2 38.8,32.94 OS2.E 38.49,32.62 38.49,28.05 37.93,27.49 v37.93,24.19 | v53.82,30.66 53.5,30.99 53.5,31.96 54.19,32.66 57.32,32.66 58.39,33.73 58.39,36.53 60.35,38.49 60.35,43.71 U1.24
  Bottom 0.5: v53.82,30.66 53.79,30.66 52.81,29.68 46.65,29.68 43.06,26.09 43.06,17.29 42.4,16.63 41.1,16.63 37.93,19.81 v37.93,24.19
SIGNAL_3  (via drill 0.35)
  Top 0.5: R6.2 28.38,30.66 27.73,30.66 26.09,29.03 OS3.E | U1.25 62.17,42.31 62.17,39.33 59.31,36.48 59.31,32.04 59.37,31.99 v59.37,31.64 | v48.28,15.65 46.6,15.65 43.79,12.84 37.73,12.84 28.05,22.51 v28.05,26.74
  Bottom 0.5: v59.37,31.64 57.08,31.64 52.84,27.4 52.84,20.22 v48.28,15.65 | v28.05,26.74 26.09,28.7 OS3.E
SIGNAL_4
  Top 0.5: R12.2 66.22,31.96 63.61,31.96 OS4.E 63.61,32.29 63.61,38.16 62.96,38.81 62.96,42.08 U1.26
SIGNAL_5  (via drill 0.35)
  Top 0.5: R10.2 73.07,25.44 73.72,25.44 75.68,27.4 OS5.E
  Top 0.508: U1.19 59.18,47.81 v58.69,48.3
  Bottom 0.508: OS5.E 58.18,9.93 40.74,9.93 26.3,24.37 26.3,26.54 22.85,29.99 20.86,29.99 19.13,31.72 19.13,34.29 20.51,35.66 20.51,37.19 18.97,38.73 18.97,40.73 19.38,41.14 19.38,43.39 19.36,43.41 19.36,54.7 43.05,78.39 48.04,78.39 49.14,77.29 49.14,75.49 46.87,73.22 46.87,60.12 v58.69,48.3
SIGNAL_6  (via drill 0.35)
  Top 0.5: OS6.E 50.89,21.2 50.89,17.94 R8.2 50.89,17.61 51.86,16.63 58.39,16.63 58.71,16.31 v60.02,16.31 | U1.22 62.56,45.41 v62.63,45.34 | v68.5,36.2 v68.5,39.47
  Bottom 0.5: v68.5,39.47 v62.63,45.34 | v68.5,36.2 68.54,36.2 71.27,33.48 71.27,26.57 61.01,16.31 v60.02,16.31
SS  (via drill 0.35)
  Top 0.508: v56.63,27.56 56.63,25.01 57.37,24.27 58.56,24.27 60.31,26.02 60.31,31.98 59.97,32.32 59.97,35.96 v60.44,36.43 | v64.15,49.22 63.76,49.61 U1.14
  Bottom 0.508: JP3.4 56.09,18.63 56.12,18.63 56.67,19.18 59.77,19.18 61.57,20.98 61.57,25.17 59.18,27.56 v56.63,27.56 | v60.44,36.43 60.44,39.41 60.96,39.93 60.96,48.92 62.12,50.08 63.29,50.08 v64.15,49.22
TX  (via drill 0.35)
  Top 0.5: v66.87,44.36 66.87,42.4 U1.31 | v60.82,55.94 58.9,55.94 v58.04,55.08 | v56.22,53.04 53.58,53.04 45.53,44.99 45.53,26.53 48.03,24.03 54.25,24.03 55.13,23.16 JP3.8
  Bottom 0.5: v58.04,55.08 58.04,54.86 v56.22,53.04 | v60.82,55.94 68.01,48.75 68.01,47.64 66.87,46.5 v66.87,44.36
V+  (via drill 0.35)
  Top 0.5: R17.1 54.8,72.41 54.8,75.02 53.82,76 C6.+ 53.5,76 52.52,76 51.54,75.02 49.25,75.02 45.99,71.76 C7.1 | 42.57,74.86 44.04,76.33 C4.+ | 42.57,74.86 41.75,74.04 41.75,71.11 42.08,70.78 42.4,70.78 43.06,70.13 M47/100V.1 | 42.57,74.86 45.99,71.43 C7.1 | C10.1 50.56,71.11 49.91,71.11 48.93,70.13 46.97,70.13 45.99,71.11 C7.1 | IC2.6 82.85,39.79 82.2,39.79 80.9,38.49 80.9,36.2 R19.2 80.57,35.88 80.57,35.55 78.29,33.27 v77.96,33.27
  Bottom 0.5: v77.96,33.27 74.95,30.26 74.95,27.91 58.62,11.57 41.31,11.57 | C4.+ 44.04,76.33 44.04,72.09 35.88,63.93 35.88,61.32 35.66,61.01
  Bottom 1.016: JP1.2 JP1.4 JP1.6 JP1.8 46.21,17.85 47.11,16.95 47.11,12.45 46.23,11.57 41.31,11.57 30.46,22.42 30.46,29.04 20.53,38.96 20.53,52.87 28.67,61.01 35.66,61.01 49.29,47.38 57.06,47.38 58.46,45.98 58.46,44.12 57.21,42.87 45.95,42.87 43.79,45.03 TR2.1 40.91,49.47 IO1.5

### Text on the board
tNames: Jakub Gal | 2020
bNames: Jakub Gal | 2020